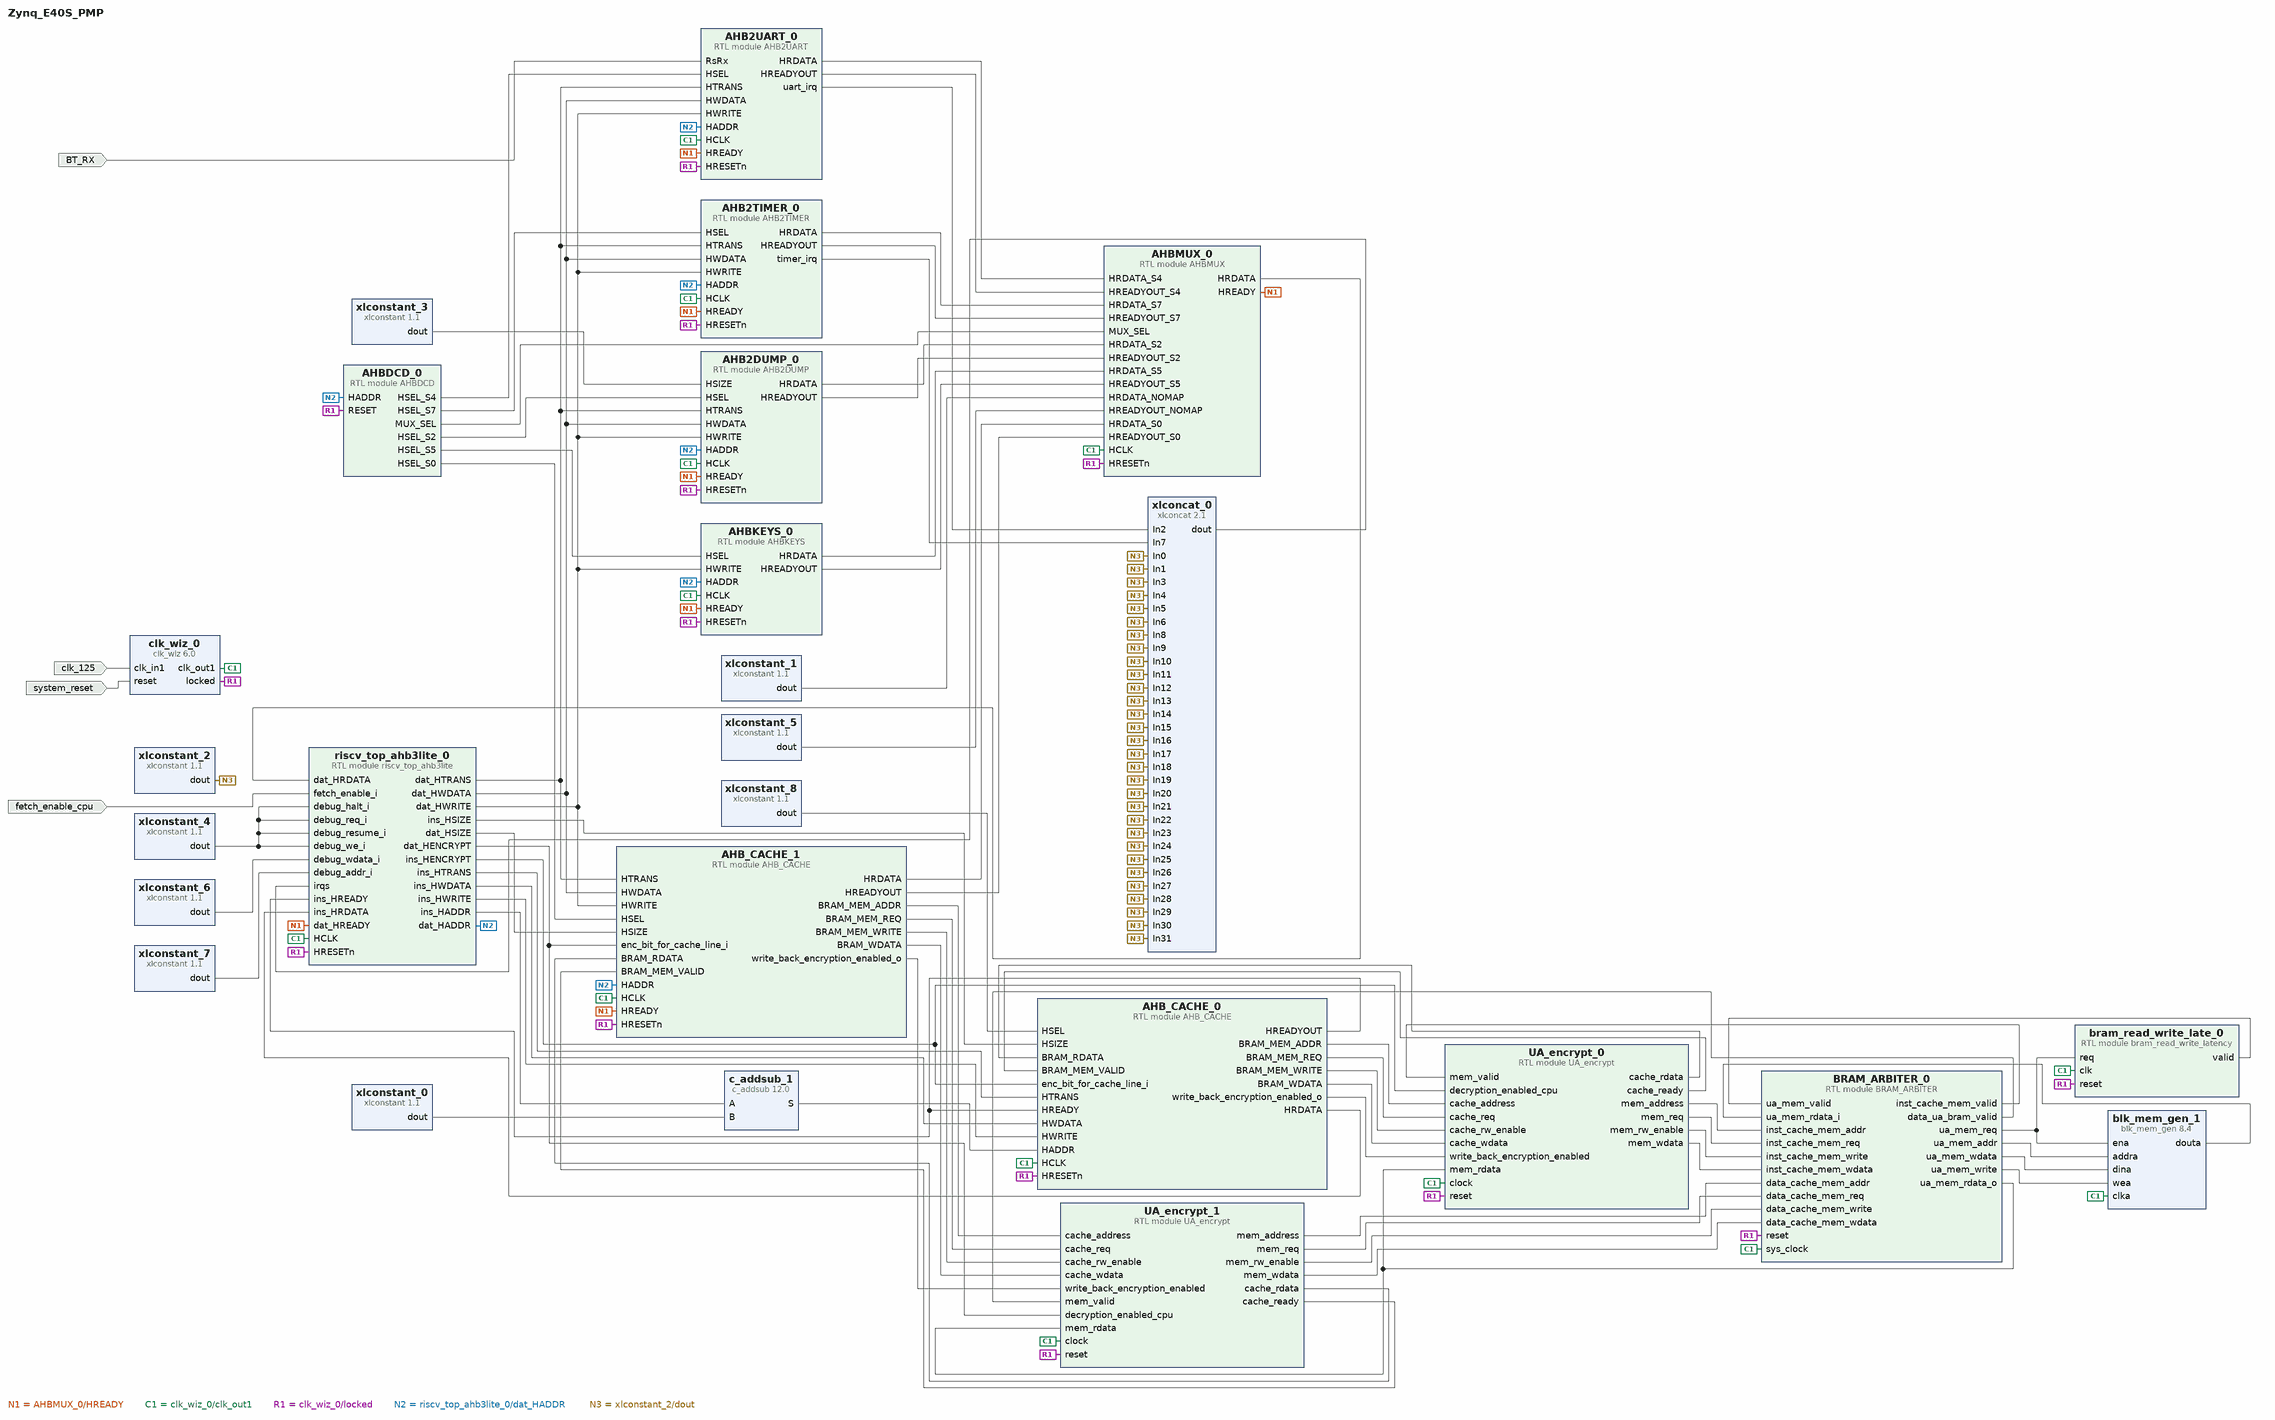
[diagram p0: block diagram of the top level]
# Vivado block design Zynq_E40S_PMP, xc7z020clg400-1, Vivado 2023.1.1
create_bd_design Zynq_E40S_PMP

create_bd_port -dir I BT_RX
create_bd_port -dir I clk_125
create_bd_port -dir I system_reset
create_bd_port -dir I fetch_enable_cpu

create_bd_cell -type module -reference AHBKEYS AHBKEYS_0
create_bd_cell -type module -reference AHB2TIMER AHB2TIMER_0
create_bd_cell -type module -reference AHB2UART AHB2UART_0
create_bd_cell -type module -reference AHB2DUMP AHB2DUMP_0
create_bd_cell -type ip -vlnv xilinx.com:ip:xlconcat:2.1 xlconcat_0
set_property -dict [list \
  CONFIG.IN0_WIDTH 1 \
  CONFIG.IN10_WIDTH 1 \
  CONFIG.IN11_WIDTH 1 \
  CONFIG.IN12_WIDTH 1 \
  CONFIG.IN13_WIDTH 1 \
  CONFIG.IN14_WIDTH 1 \
  CONFIG.IN15_WIDTH 1 \
  CONFIG.IN16_WIDTH 1 \
  CONFIG.IN17_WIDTH 1 \
  CONFIG.IN18_WIDTH 1 \
  CONFIG.IN19_WIDTH 1 \
  CONFIG.IN1_WIDTH 1 \
  CONFIG.IN20_WIDTH 1 \
  CONFIG.IN21_WIDTH 1 \
  CONFIG.IN22_WIDTH 1 \
  CONFIG.IN23_WIDTH 1 \
  CONFIG.IN24_WIDTH 1 \
  CONFIG.IN25_WIDTH 1 \
  CONFIG.IN26_WIDTH 1 \
  CONFIG.IN27_WIDTH 1 \
  CONFIG.IN28_WIDTH 1 \
  CONFIG.IN29_WIDTH 1 \
  CONFIG.IN2_WIDTH 1 \
  CONFIG.IN30_WIDTH 1 \
  CONFIG.IN31_WIDTH 1 \
  CONFIG.IN3_WIDTH 1 \
  CONFIG.IN4_WIDTH 1 \
  CONFIG.IN5_WIDTH 1 \
  CONFIG.IN6_WIDTH 1 \
  CONFIG.IN7_WIDTH 1 \
  CONFIG.IN8_WIDTH 1 \
  CONFIG.IN9_WIDTH 1 \
  CONFIG.NUM_PORTS 32 \
] [get_bd_cells xlconcat_0]
create_bd_cell -type ip -vlnv xilinx.com:ip:blk_mem_gen:8.4 blk_mem_gen_1
set_property -dict [list \
  CONFIG.Coe_File ../../../../../../E40S_PMP.sim/sim_1/behav/xsim/code_and_data.coe \
  CONFIG.Load_Init_File true \
  CONFIG.Write_Depth_A 35000 \
  CONFIG.Write_Width_A 128 \
  CONFIG.use_bram_block Stand_Alone \
] [get_bd_cells blk_mem_gen_1]
create_bd_cell -type ip -vlnv xilinx.com:ip:c_addsub:12.0 c_addsub_1
set_property -dict [list \
  CONFIG.A_Type Unsigned \
  CONFIG.A_Width 32 \
  CONFIG.Add_Mode Subtract \
  CONFIG.B_Type Unsigned \
  CONFIG.B_Value 00000000000000000000000000000000 \
  CONFIG.B_Width 32 \
  CONFIG.CE false \
  CONFIG.Implementation Fabric \
  CONFIG.Latency 0 \
  CONFIG.Out_Width 32 \
] [get_bd_cells c_addsub_1]
create_bd_cell -type ip -vlnv xilinx.com:ip:xlconstant:1.1 xlconstant_0
set_property -dict {CONFIG.CONST_VAL 0x1c000000 CONFIG.CONST_WIDTH 32} [get_bd_cells xlconstant_0]
create_bd_cell -type ip -vlnv xilinx.com:ip:xlconstant:1.1 xlconstant_1
set_property -dict {CONFIG.CONST_VAL 0xDEADBEEF CONFIG.CONST_WIDTH 32} [get_bd_cells xlconstant_1]
create_bd_cell -type ip -vlnv xilinx.com:ip:xlconstant:1.1 xlconstant_2
set_property -dict {CONFIG.CONST_VAL 0 CONFIG.CONST_WIDTH 1} [get_bd_cells xlconstant_2]
create_bd_cell -type ip -vlnv xilinx.com:ip:xlconstant:1.1 xlconstant_3
set_property -dict {CONFIG.CONST_VAL 0 CONFIG.CONST_WIDTH 3} [get_bd_cells xlconstant_3]
create_bd_cell -type ip -vlnv xilinx.com:ip:xlconstant:1.1 xlconstant_4
set_property -dict {CONFIG.CONST_VAL 0} [get_bd_cells xlconstant_4]
create_bd_cell -type ip -vlnv xilinx.com:ip:xlconstant:1.1 xlconstant_6
set_property -dict {CONFIG.CONST_VAL 0 CONFIG.CONST_WIDTH 32} [get_bd_cells xlconstant_6]
create_bd_cell -type ip -vlnv xilinx.com:ip:xlconstant:1.1 xlconstant_7
set_property -dict {CONFIG.CONST_VAL 0 CONFIG.CONST_WIDTH 15} [get_bd_cells xlconstant_7]
create_bd_cell -type ip -vlnv xilinx.com:ip:xlconstant:1.1 xlconstant_8
set_property -dict {CONFIG.CONST_VAL 1} [get_bd_cells xlconstant_8]
create_bd_cell -type ip -vlnv xilinx.com:ip:clk_wiz:6.0 clk_wiz_0
create_bd_cell -type module -reference riscv_top_ahb3lite riscv_top_ahb3lite_0
set_property -dict {CONFIG.BOOT_ADDR 0x1c005000 CONFIG.PMP_ENCRYPTION_ENABLED 1} [get_bd_cells riscv_top_ahb3lite_0]
create_bd_cell -type module -reference AHBDCD AHBDCD_0
create_bd_cell -type ip -vlnv xilinx.com:ip:xlconstant:1.1 xlconstant_5
create_bd_cell -type module -reference AHBMUX AHBMUX_0
create_bd_cell -type module -reference AHB_CACHE AHB_CACHE_0
create_bd_cell -type module -reference AHB_CACHE AHB_CACHE_1
create_bd_cell -type module -reference bram_read_write_latency bram_read_write_late_0
create_bd_cell -type module -reference BRAM_ARBITER BRAM_ARBITER_0
create_bd_cell -type module -reference UA_encrypt UA_encrypt_0
create_bd_cell -type module -reference UA_encrypt UA_encrypt_1

# ---- connections ----

connect_bd_net [get_bd_pins AHB2DUMP_0/HRDATA] [get_bd_pins AHBMUX_0/HRDATA_S2]
connect_bd_net [get_bd_pins AHB2DUMP_0/HREADYOUT] [get_bd_pins AHBMUX_0/HREADYOUT_S2]
connect_bd_net [get_bd_pins AHB2TIMER_0/HRDATA] [get_bd_pins AHBMUX_0/HRDATA_S7]
connect_bd_net [get_bd_pins AHB2TIMER_0/HREADYOUT] [get_bd_pins AHBMUX_0/HREADYOUT_S7]
connect_bd_net [get_bd_pins AHB2TIMER_0/timer_irq] [get_bd_pins xlconcat_0/In7]
connect_bd_net [get_bd_pins AHB2UART_0/HRDATA] [get_bd_pins AHBMUX_0/HRDATA_S4]
connect_bd_net [get_bd_pins AHB2UART_0/HREADYOUT] [get_bd_pins AHBMUX_0/HREADYOUT_S4]
connect_bd_net [get_bd_pins AHB2UART_0/uart_irq] [get_bd_pins xlconcat_0/In2]
connect_bd_net [get_bd_pins AHBDCD_0/HSEL_S0] [get_bd_pins AHB_CACHE_1/HSEL]
connect_bd_net [get_bd_pins AHBDCD_0/HSEL_S2] [get_bd_pins AHB2DUMP_0/HSEL]
connect_bd_net [get_bd_pins AHBDCD_0/HSEL_S4] [get_bd_pins AHB2UART_0/HSEL]
connect_bd_net [get_bd_pins AHBDCD_0/HSEL_S5] [get_bd_pins AHBKEYS_0/HSEL]
connect_bd_net [get_bd_pins AHBDCD_0/HSEL_S7] [get_bd_pins AHB2TIMER_0/HSEL]
connect_bd_net [get_bd_pins AHBDCD_0/MUX_SEL] [get_bd_pins AHBMUX_0/MUX_SEL]
connect_bd_net [get_bd_pins AHBKEYS_0/HRDATA] [get_bd_pins AHBMUX_0/HRDATA_S5]
connect_bd_net [get_bd_pins AHBKEYS_0/HREADYOUT] [get_bd_pins AHBMUX_0/HREADYOUT_S5]
connect_bd_net [get_bd_pins AHBMUX_0/HRDATA] [get_bd_pins riscv_top_ahb3lite_0/dat_HRDATA]
connect_bd_net [get_bd_pins AHB_CACHE_0/BRAM_MEM_ADDR] [get_bd_pins UA_encrypt_0/cache_address]
connect_bd_net [get_bd_pins AHB_CACHE_0/BRAM_MEM_REQ] [get_bd_pins UA_encrypt_0/cache_req]
connect_bd_net [get_bd_pins AHB_CACHE_0/BRAM_MEM_WRITE] [get_bd_pins UA_encrypt_0/cache_rw_enable]
connect_bd_net [get_bd_pins AHB_CACHE_0/BRAM_WDATA] [get_bd_pins UA_encrypt_0/cache_wdata]
connect_bd_net [get_bd_pins AHB_CACHE_0/HRDATA] [get_bd_pins riscv_top_ahb3lite_0/ins_HRDATA]
connect_bd_net [get_bd_pins AHB_CACHE_0/write_back_encryption_enabled_o] [get_bd_pins UA_encrypt_0/write_back_encryption_enabled]
connect_bd_net [get_bd_pins AHB_CACHE_1/BRAM_MEM_ADDR] [get_bd_pins UA_encrypt_1/cache_address]
connect_bd_net [get_bd_pins AHB_CACHE_1/BRAM_MEM_REQ] [get_bd_pins UA_encrypt_1/cache_req]
connect_bd_net [get_bd_pins AHB_CACHE_1/BRAM_MEM_WRITE] [get_bd_pins UA_encrypt_1/cache_rw_enable]
connect_bd_net [get_bd_pins AHB_CACHE_1/BRAM_WDATA] [get_bd_pins UA_encrypt_1/cache_wdata]
connect_bd_net [get_bd_pins AHB_CACHE_1/HRDATA] [get_bd_pins AHBMUX_0/HRDATA_S0]
connect_bd_net -net AHB_CACHE_1_HREADYOUT [get_bd_pins AHBMUX_0/HREADY] \
  [get_bd_pins AHBKEYS_0/HREADY] [get_bd_pins AHB2TIMER_0/HREADY] [get_bd_pins AHB2DUMP_0/HREADY] \
  [get_bd_pins AHB2UART_0/HREADY] [get_bd_pins riscv_top_ahb3lite_0/dat_HREADY] [get_bd_pins AHB_CACHE_1/HREADY]
connect_bd_net [get_bd_pins AHB_CACHE_1/HREADYOUT] [get_bd_pins AHBMUX_0/HREADYOUT_S0]
connect_bd_net [get_bd_pins AHB_CACHE_1/write_back_encryption_enabled_o] [get_bd_pins UA_encrypt_1/write_back_encryption_enabled]
connect_bd_net [get_bd_pins BRAM_ARBITER_0/data_ua_bram_valid] [get_bd_pins UA_encrypt_1/mem_valid]
connect_bd_net [get_bd_pins BRAM_ARBITER_0/inst_cache_mem_valid] [get_bd_pins UA_encrypt_0/mem_valid]
connect_bd_net [get_bd_pins BRAM_ARBITER_0/ua_mem_addr] [get_bd_pins blk_mem_gen_1/addra]
connect_bd_net [get_bd_pins BRAM_ARBITER_0/ua_mem_rdata_o] [get_bd_pins UA_encrypt_0/mem_rdata] [get_bd_pins UA_encrypt_1/mem_rdata]
connect_bd_net [get_bd_pins BRAM_ARBITER_0/ua_mem_req] [get_bd_pins blk_mem_gen_1/ena] [get_bd_pins bram_read_write_late_0/req]
connect_bd_net [get_bd_pins BRAM_ARBITER_0/ua_mem_wdata] [get_bd_pins blk_mem_gen_1/dina]
connect_bd_net [get_bd_pins BRAM_ARBITER_0/ua_mem_write] [get_bd_pins blk_mem_gen_1/wea]
connect_bd_net [get_bd_ports BT_RX] [get_bd_pins AHB2UART_0/RsRx]
connect_bd_net [get_bd_pins AHB_CACHE_0/HREADYOUT] [get_bd_pins riscv_top_ahb3lite_0/ins_HREADY] [get_bd_pins AHB_CACHE_0/HREADY]
connect_bd_net [get_bd_pins riscv_top_ahb3lite_0/dat_HENCRYPT] \
  [get_bd_pins AHB_CACHE_1/enc_bit_for_cache_line_i] [get_bd_pins UA_encrypt_1/decryption_enabled_cpu]
connect_bd_net [get_bd_pins UA_encrypt_0/cache_rdata] [get_bd_pins AHB_CACHE_0/BRAM_RDATA]
connect_bd_net [get_bd_pins UA_encrypt_0/cache_ready] [get_bd_pins AHB_CACHE_0/BRAM_MEM_VALID]
connect_bd_net [get_bd_pins UA_encrypt_0/mem_address] [get_bd_pins BRAM_ARBITER_0/inst_cache_mem_addr]
connect_bd_net [get_bd_pins UA_encrypt_0/mem_req] [get_bd_pins BRAM_ARBITER_0/inst_cache_mem_req]
connect_bd_net [get_bd_pins UA_encrypt_0/mem_rw_enable] [get_bd_pins BRAM_ARBITER_0/inst_cache_mem_write]
connect_bd_net [get_bd_pins UA_encrypt_0/mem_wdata] [get_bd_pins BRAM_ARBITER_0/inst_cache_mem_wdata]
connect_bd_net [get_bd_pins UA_encrypt_1/cache_rdata] [get_bd_pins AHB_CACHE_1/BRAM_RDATA]
connect_bd_net [get_bd_pins UA_encrypt_1/cache_ready] [get_bd_pins AHB_CACHE_1/BRAM_MEM_VALID]
connect_bd_net [get_bd_pins UA_encrypt_1/mem_address] [get_bd_pins BRAM_ARBITER_0/data_cache_mem_addr]
connect_bd_net [get_bd_pins UA_encrypt_1/mem_req] [get_bd_pins BRAM_ARBITER_0/data_cache_mem_req]
connect_bd_net [get_bd_pins UA_encrypt_1/mem_rw_enable] [get_bd_pins BRAM_ARBITER_0/data_cache_mem_write]
connect_bd_net [get_bd_pins UA_encrypt_1/mem_wdata] [get_bd_pins BRAM_ARBITER_0/data_cache_mem_wdata]
connect_bd_net [get_bd_pins blk_mem_gen_1/douta] [get_bd_pins BRAM_ARBITER_0/ua_mem_rdata_i]
connect_bd_net [get_bd_pins bram_read_write_late_0/valid] [get_bd_pins BRAM_ARBITER_0/ua_mem_valid]
connect_bd_net [get_bd_pins c_addsub_1/S] [get_bd_pins AHB_CACHE_0/HADDR]
connect_bd_net -net clk_125_1 [get_bd_ports clk_125] [get_bd_pins clk_wiz_0/clk_in1]
connect_bd_net [get_bd_pins clk_wiz_0/clk_out1] \
  [get_bd_pins AHBKEYS_0/HCLK] [get_bd_pins AHB2DUMP_0/HCLK] [get_bd_pins AHB2UART_0/HCLK] [get_bd_pins AHB2TIMER_0/HCLK] \
  [get_bd_pins blk_mem_gen_1/clka] [get_bd_pins riscv_top_ahb3lite_0/HCLK] [get_bd_pins AHBMUX_0/HCLK] \
  [get_bd_pins AHB_CACHE_0/HCLK] [get_bd_pins AHB_CACHE_1/HCLK] [get_bd_pins bram_read_write_late_0/clk] \
  [get_bd_pins BRAM_ARBITER_0/sys_clock] [get_bd_pins UA_encrypt_0/clock] [get_bd_pins UA_encrypt_1/clock]
connect_bd_net [get_bd_pins clk_wiz_0/locked] \
  [get_bd_pins AHBKEYS_0/HRESETn] [get_bd_pins AHB2DUMP_0/HRESETn] [get_bd_pins AHB2TIMER_0/HRESETn] \
  [get_bd_pins AHB2UART_0/HRESETn] [get_bd_pins riscv_top_ahb3lite_0/HRESETn] [get_bd_pins AHBDCD_0/RESET] \
  [get_bd_pins AHBMUX_0/HRESETn] [get_bd_pins AHB_CACHE_0/HRESETn] [get_bd_pins AHB_CACHE_1/HRESETn] \
  [get_bd_pins bram_read_write_late_0/reset] [get_bd_pins BRAM_ARBITER_0/reset] [get_bd_pins UA_encrypt_0/reset] \
  [get_bd_pins UA_encrypt_1/reset]
connect_bd_net [get_bd_ports fetch_enable_cpu] [get_bd_pins riscv_top_ahb3lite_0/fetch_enable_i]
connect_bd_net [get_bd_pins riscv_top_ahb3lite_0/dat_HADDR] \
  [get_bd_pins AHBKEYS_0/HADDR] [get_bd_pins AHB2DUMP_0/HADDR] [get_bd_pins AHB2TIMER_0/HADDR] [get_bd_pins AHB2UART_0/HADDR] \
  [get_bd_pins AHBDCD_0/HADDR] [get_bd_pins AHB_CACHE_1/HADDR]
connect_bd_net [get_bd_pins riscv_top_ahb3lite_0/dat_HSIZE] [get_bd_pins AHB_CACHE_1/HSIZE]
connect_bd_net [get_bd_pins riscv_top_ahb3lite_0/dat_HTRANS] \
  [get_bd_pins AHB2TIMER_0/HTRANS] [get_bd_pins AHB2DUMP_0/HTRANS] [get_bd_pins AHB2UART_0/HTRANS] \
  [get_bd_pins AHB_CACHE_1/HTRANS]
connect_bd_net [get_bd_pins riscv_top_ahb3lite_0/dat_HWDATA] \
  [get_bd_pins AHB2DUMP_0/HWDATA] [get_bd_pins AHB2TIMER_0/HWDATA] [get_bd_pins AHB2UART_0/HWDATA] \
  [get_bd_pins AHB_CACHE_1/HWDATA]
connect_bd_net [get_bd_pins riscv_top_ahb3lite_0/dat_HWRITE] \
  [get_bd_pins AHBKEYS_0/HWRITE] [get_bd_pins AHB2UART_0/HWRITE] [get_bd_pins AHB2DUMP_0/HWRITE] \
  [get_bd_pins AHB2TIMER_0/HWRITE] [get_bd_pins AHB_CACHE_1/HWRITE]
connect_bd_net [get_bd_pins riscv_top_ahb3lite_0/ins_HADDR] [get_bd_pins c_addsub_1/A]
connect_bd_net [get_bd_pins riscv_top_ahb3lite_0/ins_HENCRYPT] \
  [get_bd_pins AHB_CACHE_0/enc_bit_for_cache_line_i] [get_bd_pins UA_encrypt_0/decryption_enabled_cpu]
connect_bd_net [get_bd_pins riscv_top_ahb3lite_0/ins_HSIZE] [get_bd_pins AHB_CACHE_0/HSIZE]
connect_bd_net [get_bd_pins riscv_top_ahb3lite_0/ins_HTRANS] [get_bd_pins AHB_CACHE_0/HTRANS]
connect_bd_net [get_bd_pins riscv_top_ahb3lite_0/ins_HWDATA] [get_bd_pins AHB_CACHE_0/HWDATA]
connect_bd_net [get_bd_pins riscv_top_ahb3lite_0/ins_HWRITE] [get_bd_pins AHB_CACHE_0/HWRITE]
connect_bd_net [get_bd_ports system_reset] [get_bd_pins clk_wiz_0/reset]
connect_bd_net [get_bd_pins xlconcat_0/dout] [get_bd_pins riscv_top_ahb3lite_0/irqs]
connect_bd_net [get_bd_pins xlconstant_0/dout] [get_bd_pins c_addsub_1/B]
connect_bd_net [get_bd_pins xlconstant_1/dout] [get_bd_pins AHBMUX_0/HRDATA_NOMAP]
connect_bd_net [get_bd_pins xlconstant_2/dout] \
  [get_bd_pins xlconcat_0/In31] [get_bd_pins xlconcat_0/In30] [get_bd_pins xlconcat_0/In29] [get_bd_pins xlconcat_0/In28] \
  [get_bd_pins xlconcat_0/In27] [get_bd_pins xlconcat_0/In26] [get_bd_pins xlconcat_0/In25] [get_bd_pins xlconcat_0/In17] \
  [get_bd_pins xlconcat_0/In20] [get_bd_pins xlconcat_0/In19] [get_bd_pins xlconcat_0/In18] [get_bd_pins xlconcat_0/In21] \
  [get_bd_pins xlconcat_0/In22] [get_bd_pins xlconcat_0/In23] [get_bd_pins xlconcat_0/In24] [get_bd_pins xlconcat_0/In16] \
  [get_bd_pins xlconcat_0/In15] [get_bd_pins xlconcat_0/In14] [get_bd_pins xlconcat_0/In13] [get_bd_pins xlconcat_0/In12] \
  [get_bd_pins xlconcat_0/In11] [get_bd_pins xlconcat_0/In8] [get_bd_pins xlconcat_0/In9] [get_bd_pins xlconcat_0/In10] \
  [get_bd_pins xlconcat_0/In6] [get_bd_pins xlconcat_0/In4] [get_bd_pins xlconcat_0/In5] [get_bd_pins xlconcat_0/In0] \
  [get_bd_pins xlconcat_0/In1] [get_bd_pins xlconcat_0/In3]
connect_bd_net [get_bd_pins xlconstant_3/dout] [get_bd_pins AHB2DUMP_0/HSIZE]
connect_bd_net [get_bd_pins xlconstant_4/dout] \
  [get_bd_pins riscv_top_ahb3lite_0/debug_req_i] [get_bd_pins riscv_top_ahb3lite_0/debug_we_i] \
  [get_bd_pins riscv_top_ahb3lite_0/debug_halt_i] [get_bd_pins riscv_top_ahb3lite_0/debug_resume_i]
connect_bd_net [get_bd_pins xlconstant_5/dout] [get_bd_pins AHBMUX_0/HREADYOUT_NOMAP]
connect_bd_net [get_bd_pins xlconstant_6/dout] [get_bd_pins riscv_top_ahb3lite_0/debug_wdata_i]
connect_bd_net [get_bd_pins xlconstant_7/dout] [get_bd_pins riscv_top_ahb3lite_0/debug_addr_i]
connect_bd_net [get_bd_pins xlconstant_8/dout] [get_bd_pins AHB_CACHE_0/HSEL]

validate_bd_design
save_bd_design
